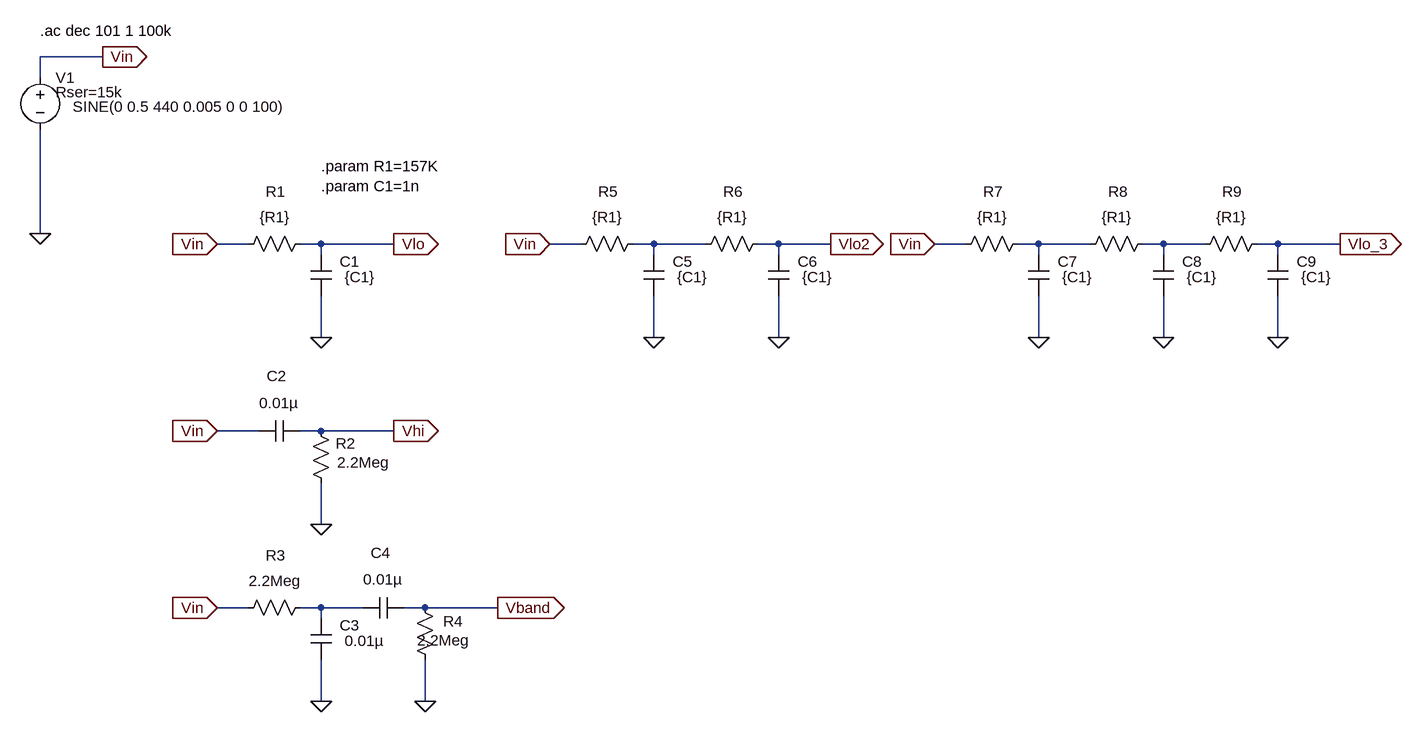
[diagram p0: schematic filter-calculator.asc]
filter-calculator.asc, the LTspice schematic file:
Version 4
SHEET 1 1904 1072
WIRE -112 64 -208 64
WIRE -208 96 -208 64
WIRE -208 336 -208 176
WIRE 112 352 64 352
WIRE 224 352 192 352
WIRE 336 352 224 352
WIRE 624 352 576 352
WIRE 736 352 704 352
WIRE 816 352 736 352
WIRE 928 352 896 352
WIRE 1008 352 928 352
WIRE 1216 352 1168 352
WIRE 1328 352 1296 352
WIRE 1408 352 1328 352
WIRE 1520 352 1488 352
WIRE 1584 352 1520 352
WIRE 1696 352 1664 352
WIRE 1792 352 1696 352
WIRE 224 368 224 352
WIRE 736 368 736 352
WIRE 928 368 928 352
WIRE 1328 368 1328 352
WIRE 1520 368 1520 352
WIRE 1696 368 1696 352
WIRE 224 496 224 432
WIRE 736 496 736 432
WIRE 928 496 928 432
WIRE 1328 496 1328 432
WIRE 1520 496 1520 432
WIRE 1696 496 1696 432
WIRE 128 640 64 640
WIRE 224 640 192 640
WIRE 336 640 224 640
WIRE 224 784 224 720
WIRE 112 912 64 912
WIRE 224 912 192 912
WIRE 288 912 224 912
WIRE 384 912 352 912
WIRE 496 912 384 912
WIRE 224 928 224 912
WIRE 224 1056 224 992
WIRE 384 1056 384 992
FLAG -208 336 0
FLAG -112 64 Vin
IOPIN -112 64 Out
FLAG 224 784 0
FLAG 64 640 Vin
IOPIN 64 640 In
FLAG 336 640 Vhi
IOPIN 336 640 Out
FLAG 224 496 0
FLAG 64 352 Vin
IOPIN 64 352 In
FLAG 336 352 Vlo
IOPIN 336 352 Out
FLAG 224 1056 0
FLAG 64 912 Vin
IOPIN 64 912 In
FLAG 384 1056 0
FLAG 496 912 Vband
IOPIN 496 912 Out
FLAG 736 496 0
FLAG 576 352 Vin
IOPIN 576 352 In
FLAG 1008 352 Vlo2
IOPIN 1008 352 Out
FLAG 928 496 0
FLAG 1328 496 0
FLAG 1168 352 Vin
IOPIN 1168 352 In
FLAG 1520 496 0
FLAG 1696 496 0
FLAG 1792 352 Vlo_3
IOPIN 1792 352 Out
SYMBOL voltage -208 80 R0
WINDOW 3 50 61 Left 2
WINDOW 39 24 38 Left 2
SYMATTR Value SINE(0 0.5 440 0.005 0 0 100)
SYMATTR SpiceLine Rser=15k
SYMATTR InstName V1
SYMATTR Value2 AC 0.5
SYMBOL res 208 336 R90
WINDOW 0 -49 54 VBottom 2
WINDOW 3 -41 55 VTop 2
SYMATTR InstName R1
SYMATTR Value {R1}
SYMBOL res 240 736 R180
WINDOW 0 -37 77 Left 2
WINDOW 3 -90 48 Left 2
SYMATTR InstName R2
SYMATTR Value 2.2Meg
SYMBOL cap 208 368 R0
WINDOW 0 45 11 Left 2
WINDOW 3 52 35 Left 2
SYMATTR InstName C1
SYMATTR Value {C1}
SYMBOL cap 192 624 R90
WINDOW 0 -53 36 VBottom 2
WINDOW 3 -43 33 VTop 2
SYMATTR InstName C2
SYMATTR Value 0.01µ
SYMBOL res 208 896 R90
WINDOW 0 -49 54 VBottom 2
WINDOW 3 -41 55 VTop 2
SYMATTR InstName R3
SYMATTR Value 2.2Meg
SYMBOL cap 208 928 R0
WINDOW 0 45 11 Left 2
WINDOW 3 52 35 Left 2
SYMATTR InstName C3
SYMATTR Value 0.01µ
SYMBOL res 400 1008 R180
WINDOW 0 -43 75 Left 2
WINDOW 3 -53 46 Left 2
SYMATTR InstName R4
SYMATTR Value 2.2Meg
SYMBOL cap 352 896 R90
WINDOW 0 -53 36 VBottom 2
WINDOW 3 -43 33 VTop 2
SYMATTR InstName C4
SYMATTR Value 0.01µ
SYMBOL res 720 336 R90
WINDOW 0 -49 54 VBottom 2
WINDOW 3 -41 55 VTop 2
SYMATTR InstName R5
SYMATTR Value {R1}
SYMBOL cap 720 368 R0
WINDOW 0 45 11 Left 2
WINDOW 3 52 35 Left 2
SYMATTR InstName C5
SYMATTR Value {C1}
SYMBOL res 912 336 R90
WINDOW 0 -49 54 VBottom 2
WINDOW 3 -41 55 VTop 2
SYMATTR InstName R6
SYMATTR Value {R1}
SYMBOL cap 912 368 R0
WINDOW 0 45 11 Left 2
WINDOW 3 52 35 Left 2
SYMATTR InstName C6
SYMATTR Value {C1}
SYMBOL res 1312 336 R90
WINDOW 0 -49 54 VBottom 2
WINDOW 3 -41 55 VTop 2
SYMATTR InstName R7
SYMATTR Value {R1}
SYMBOL cap 1312 368 R0
WINDOW 0 45 11 Left 2
WINDOW 3 52 35 Left 2
SYMATTR InstName C7
SYMATTR Value {C1}
SYMBOL res 1504 336 R90
WINDOW 0 -49 54 VBottom 2
WINDOW 3 -41 55 VTop 2
SYMATTR InstName R8
SYMATTR Value {R1}
SYMBOL cap 1504 368 R0
WINDOW 0 45 11 Left 2
WINDOW 3 52 35 Left 2
SYMATTR InstName C8
SYMATTR Value {C1}
SYMBOL res 1680 336 R90
WINDOW 0 -49 54 VBottom 2
WINDOW 3 -41 55 VTop 2
SYMATTR InstName R9
SYMATTR Value {R1}
SYMBOL cap 1680 368 R0
WINDOW 0 45 11 Left 2
WINDOW 3 52 35 Left 2
SYMATTR InstName C9
SYMATTR Value {C1}
TEXT -208 24 Left 2 !.ac dec 101 1 100k
TEXT 224 232 Left 2 !.param R1=157K\n.param C1=1n

The netlist it stands for:
* filter-calculator.asc
V1 Vin 0 SINE(0 0.5 440 0.005 0 0 100) AC 0.5 Rser=15k
R1 Vlo Vin {R1}
R2 0 Vhi 2.2Meg
C1 Vlo 0 {C1}
C2 Vhi Vin 0.01µ
R3 N004 Vin 2.2Meg
C3 N004 0 0.01µ
R4 0 Vband 2.2Meg
C4 Vband N004 0.01µ
R5 N001 Vin {R1}
C5 N001 0 {C1}
R6 Vlo2 N001 {R1}
C6 Vlo2 0 {C1}
R7 N002 Vin {R1}
C7 N002 0 {C1}
R8 N003 N002 {R1}
C8 N003 0 {C1}
R9 Vlo_3 N003 {R1}
C9 Vlo_3 0 {C1}
.ac dec 101 1 100k
.param R1=157K
.param C1=1n
.backanno
.end